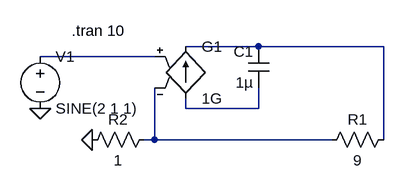
[diagram p0: schematic ideal_amp.asc]
ideal_amp.asc, the LTspice schematic file:
Version 4
SHEET 1 880 680
WIRE 512 224 400 224
WIRE 704 224 512 224
WIRE 352 240 176 240
WIRE 400 320 400 304
WIRE 512 320 512 288
WIRE 512 320 400 320
WIRE 352 368 352 288
WIRE 352 368 336 368
WIRE 624 368 352 368
WIRE 704 368 704 224
FLAG 256 368 0
FLAG 176 320 0
SYMBOL voltage 176 224 R0
SYMATTR InstName V1
SYMATTR Value SINE(2 1 1)
SYMBOL g 400 208 R0
SYMATTR InstName G1
SYMATTR Value 1G
SYMBOL res 720 352 R90
WINDOW 0 0 56 VBottom 2
WINDOW 3 32 56 VTop 2
SYMATTR InstName R1
SYMATTR Value 9
SYMBOL res 352 352 R90
WINDOW 0 0 56 VBottom 2
WINDOW 3 32 56 VTop 2
SYMATTR InstName R2
SYMATTR Value 1
SYMBOL cap 528 224 M0
SYMATTR InstName C1
SYMATTR Value 1µ
TEXT 224 200 Left 2 !.tran 10

The netlist it stands for:
* ideal_amp.asc
V1 N002 0 SINE(2 1 1)
G1 N003 N001 N002 N004 1G
R1 N001 N004 9
R2 N004 0 1
C1 N001 N003 1µ
.tran 10
.backanno
.end